# Altium project PIC16F1825 - HD44780 LCD CLock.PrjPcb
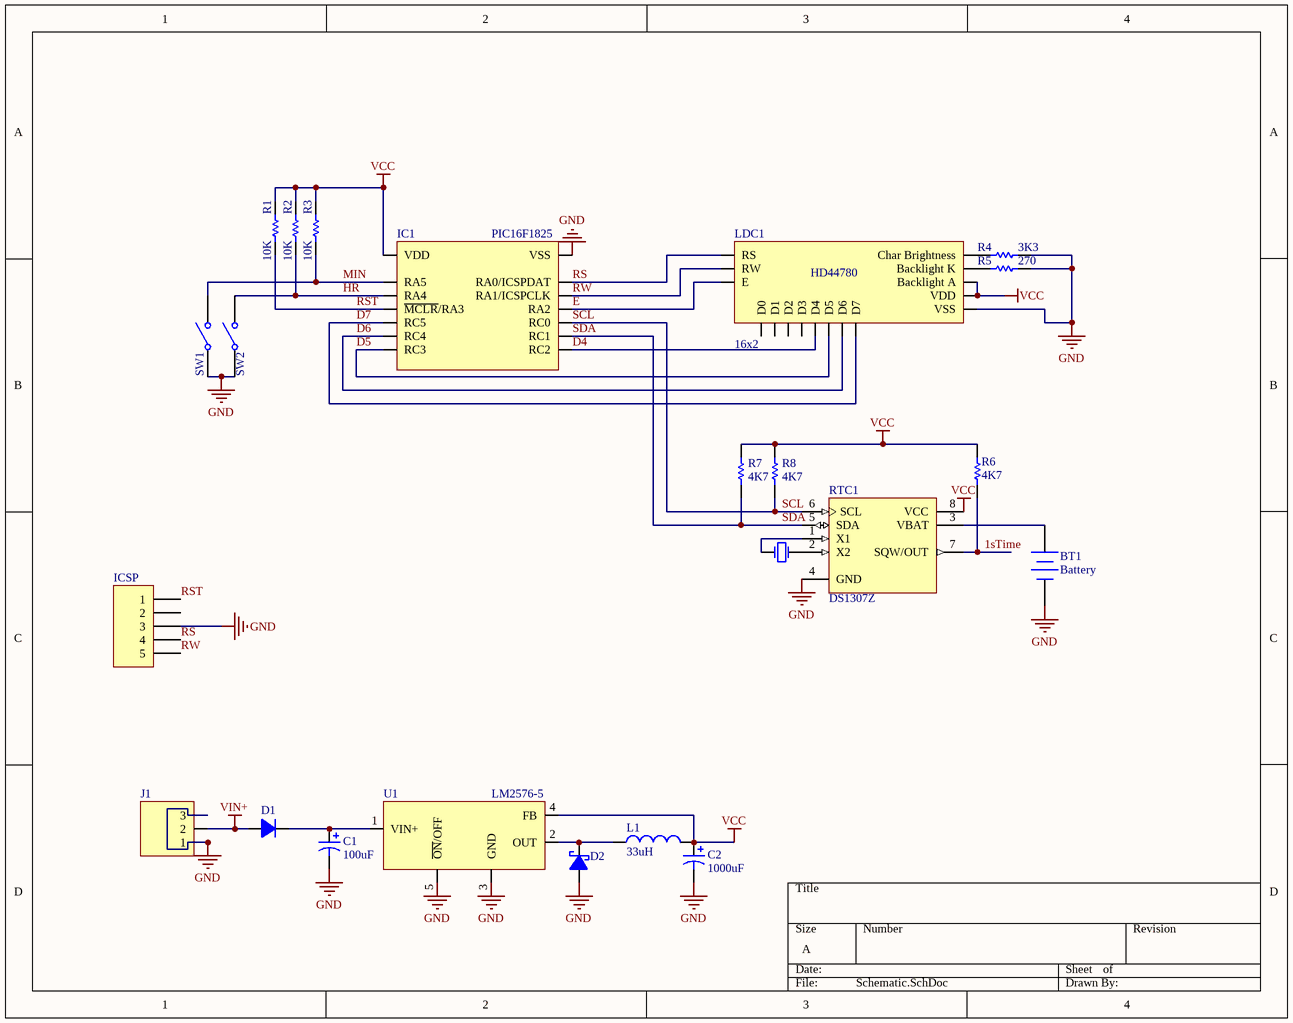
[diagram p0: Schematic.SchDoc]
1 sheet, 23 parts. Net scope: global (net labels, ports and power ports of the same name join across sheets).
Board file: PCB.PcbDoc

## Sheet Schematic.SchDoc
size A; PageSetup: Record=PageOptions|CenterHorizontal=True|CenterVertical=True|PrintScale=0.88|XCorrection=1.00|YCorrection=1.00|PrintKind=1|BorderSize=5000000|LeftOffset=0|BottomOffset=0|Orientation=1|PaperLength=2794|PaperWidth=2159|Scale=100|PaperSource=7|PrintQuality=600|MediaType=1|DitherType=10|PaperKind=Letter|PrintScaleMode=1

### Parts
BT1  Battery  [CR2032 Holder]
C1  value 100uF  [Electrolytic Cap2]  (hidden comment: 100uF / 50V)
C2  value 1000uF  [Electrolytic Cap2]  (hidden comment: 1000uF / 16V)
D1  Diode  [Axial 0.3 - Polarized]  (value not drawn)
D2  1N5822  [Axial 0.3 - Polarized]  (value not drawn)
IC1  PIC16F1825  [DIP14-300mil]
ICSP  Header 5  [HDR1X5]  (value not drawn)
J1  Jack Mini Inline  [Jack Mini Inline]  (value not drawn)
L1  value 33uH  [CW8A]  (hidden comment: Inductor)
LDC1  16x2  [HD44780]
R1  value 10K  [0805]  (hidden comment: Res)
R2  value 10K  [0805]  (hidden comment: Res)
R3  value 10K  [0805]  (hidden comment: Res)
R4  value 3K3  [Axial 0.4]  (hidden comment: Res)
R5  value 270  [Axial 0.4]  (hidden comment: Res)
R6  value 4K7  [0805]  (hidden comment: Res)
R7  value 4K7  [0805]  (hidden comment: Res)
R8  value 4K7  [0805]  (hidden comment: Res)
RTC1  DS1307Z  [SOIC8N_N]
SW1  Switch  [SMD Switch 2pin]  (value not drawn)
SW2  Switch  [SMD Switch 2pin]  (value not drawn)
U1  LM2576-5  [TO263-5]
Y1  XTAL  [XTAL-Watch]  (value not drawn)

### Nets
GND: BT1.2(-) C1.2 C2.2 D2.A IC1.14(VSS) ICSP.3 J1.1 J1.3 LDC1.VSS R4.2 R5.1 RTC1.4(GND) SW1.1(COMMON1) SW2.1(COMMON1) U1.3(GND) U1.5(~{ON}/OFF)
VCC: C2.1 IC1.1(VDD) L1.2 LDC1.A(Backlight_A) LDC1.VDD R1.2 R2.2 R3.2 R6.1 R7.2 R8.2 RTC1.8(VCC) U1.4(FB)
VIN+: D1.A J1.2
1sTime: R6.2 RTC1.7(SQW/OUT)
D4: IC1.8(RC2) LDC1.D4
D5: IC1.7(RC3) LDC1.D5
D6: IC1.6(RC4) LDC1.D6
D7: IC1.5(RC5) LDC1.D7
E: IC1.11(RA2) LDC1.E
HR: IC1.3(RA4) R2.1 SW2.2(COMMON2)
MIN: IC1.2(RA5) R3.1 SW1.2(COMMON2)
RS: IC1.13(RA0/ICSPDAT) ICSP.4 LDC1.RS
RST: IC1.4(~{MCLR}/RA3) ICSP.1 R1.1
RW: IC1.12(RA1/ICSPCLK) ICSP.5 LDC1.RW
SCL: IC1.10(RC0) R8.1 RTC1.6(SCL)
SDA: IC1.9(RC1) R7.1 RTC1.5(SDA)
NetBT1_1: BT1.1(+) RTC1.3(VBAT)
NetC1_1: C1.1 D1.K U1.1(VIN+)
NetD2_K: D2.K L1.1 U1.2(OUT)
NetLDC1_BRTN: LDC1.BRTN(Char_Brightness) R4.1
NetLDC1_K: LDC1.K(Backlight_K) R5.2
NetRTC1_1: RTC1.1(X1) Y1.1(OSC1)
NetRTC1_2: RTC1.2(X2) Y1.2(OSC2)

Not connected (* = marked no-connect by the designer): ICSP 2; LDC1 D0 D1 D2 D3

### Library data of the parts
BT1 = Battery: Multicell Battery; Published: 24-Mar-1999; LatestRevisionDate: 17-Jul-2002; LatestRevisionNote: Re-released for DXP Platform.; PackageReference: BAT-2; Publisher: Altium Limited; PackageDescription: Battery; 2 Leads
C1 C2 = Cap Electrolytic: Polarized Capacitor (Axial); Published: 8-Jun-2000; LatestRevisionDate: 17-Jul-2002; LatestRevisionNote: Re-released for DXP Platform.; PackageReference: POLAR0.8; Publisher: Altium Limited; PackageDescription: Polarized Capacitor; 2 Leads
D2 = Diode Schotky: Published: 8-Jun-2000; LatestRevisionDate: 08-Jul-2005; LatestRevisionNote: Mech Layer 1 removed.; PackageReference: LED-1; Publisher: Altium Limited; PackageDescription: LED; 2 Leads
ICSP = Header 5: Header, 5-Pin; LatestRevisionDate: 17-Jul-2002; LatestRevisionNote: Re-released for DXP Platform.; Publisher: Altium Limited
L1 = Inductor: Code_IEC: 1005; Published: 8-Jun-2000; LatestRevisionDate: 29-May-2009; LatestRevisionNote: IPC-7351 Footprint Added.; PackageReference: 0402-A; Publisher: Altium Limited; PackageDescription: Chip Inductor; Code_JEITA: 0402
LDC1 = HD44780: HD44780 16x2 LCD Display; Note: Char brightness is max @ GND lvl; eBay Link: http://www.ebay.com/itm/181295337227?ssPageName=STRK:MEWNX:IT&_trksid=p3984.m1439.l2649; Characters: 16x2
R1-R8 = Res: Resistor; Published: 8-Jun-2000; LatestRevisionDate: 17-Jul-2002; LatestRevisionNote: Re-released for DXP Platform.; PackageReference: AXIAL-0.3; Publisher: Altium Limited; PackageDescription: Axial Device, Thru-Hole; 2 Leads; 0.3 in Pin Spacing
RTC1 = DS1307Z: 64 X 8 Serial Real-Time Clock; Published: 13-Oct-2000; LatestRevisionDate: 13-Apr-2006; LatestRevisionNote: IPC-7351 Footprint Added.; DatasheetVersion: 10-Aug-1999; PackageVersion: 1999; PackageReference: SOIC8N; Publisher: Altium Limited; PackageDescription: 8-Pin Small Outline Integrated Circuit 1.27 mm Pitch; Code_IPC: SOIC127P600-8; ComponentLink1Description: Manufacturer Link; ComponentLink1URL: http://www.maxim-ic.com/; ComponentLink2Description: Datasheet; ComponentLink2URL: http://pdfserv.maxim-ic.com/en/ds/DS1307.pdf; ComponentLink3Description: Discontinuation Notice; ComponentLink3URL: http://www.maxim-ic.com/qa/pdfs/non-obsolescence-letter.pdf
U1 = LM257-xx
Y1 = XTAL: Crystal Oscillator; Published: 8-Jun-2000; LatestRevisionDate: 17-Jul-2002; LatestRevisionNote: Re-released for DXP Platform.; PackageReference: R38; Publisher: Altium Limited; PackageDescription: Crystal, Thru-Hole; 2 Leads; Body 3.1 x 8.2 mm (Dia.xH)
D1 = Diode: Published: 8-Jun-2000; LatestRevisionDate: 08-Jul-2005; LatestRevisionNote: Mech Layer 1 removed.; PackageReference: LED-1; Publisher: Altium Limited; PackageDescription: LED; 2 Leads